# EAGLE schematic schema_puissance (EAGLE 6.4)
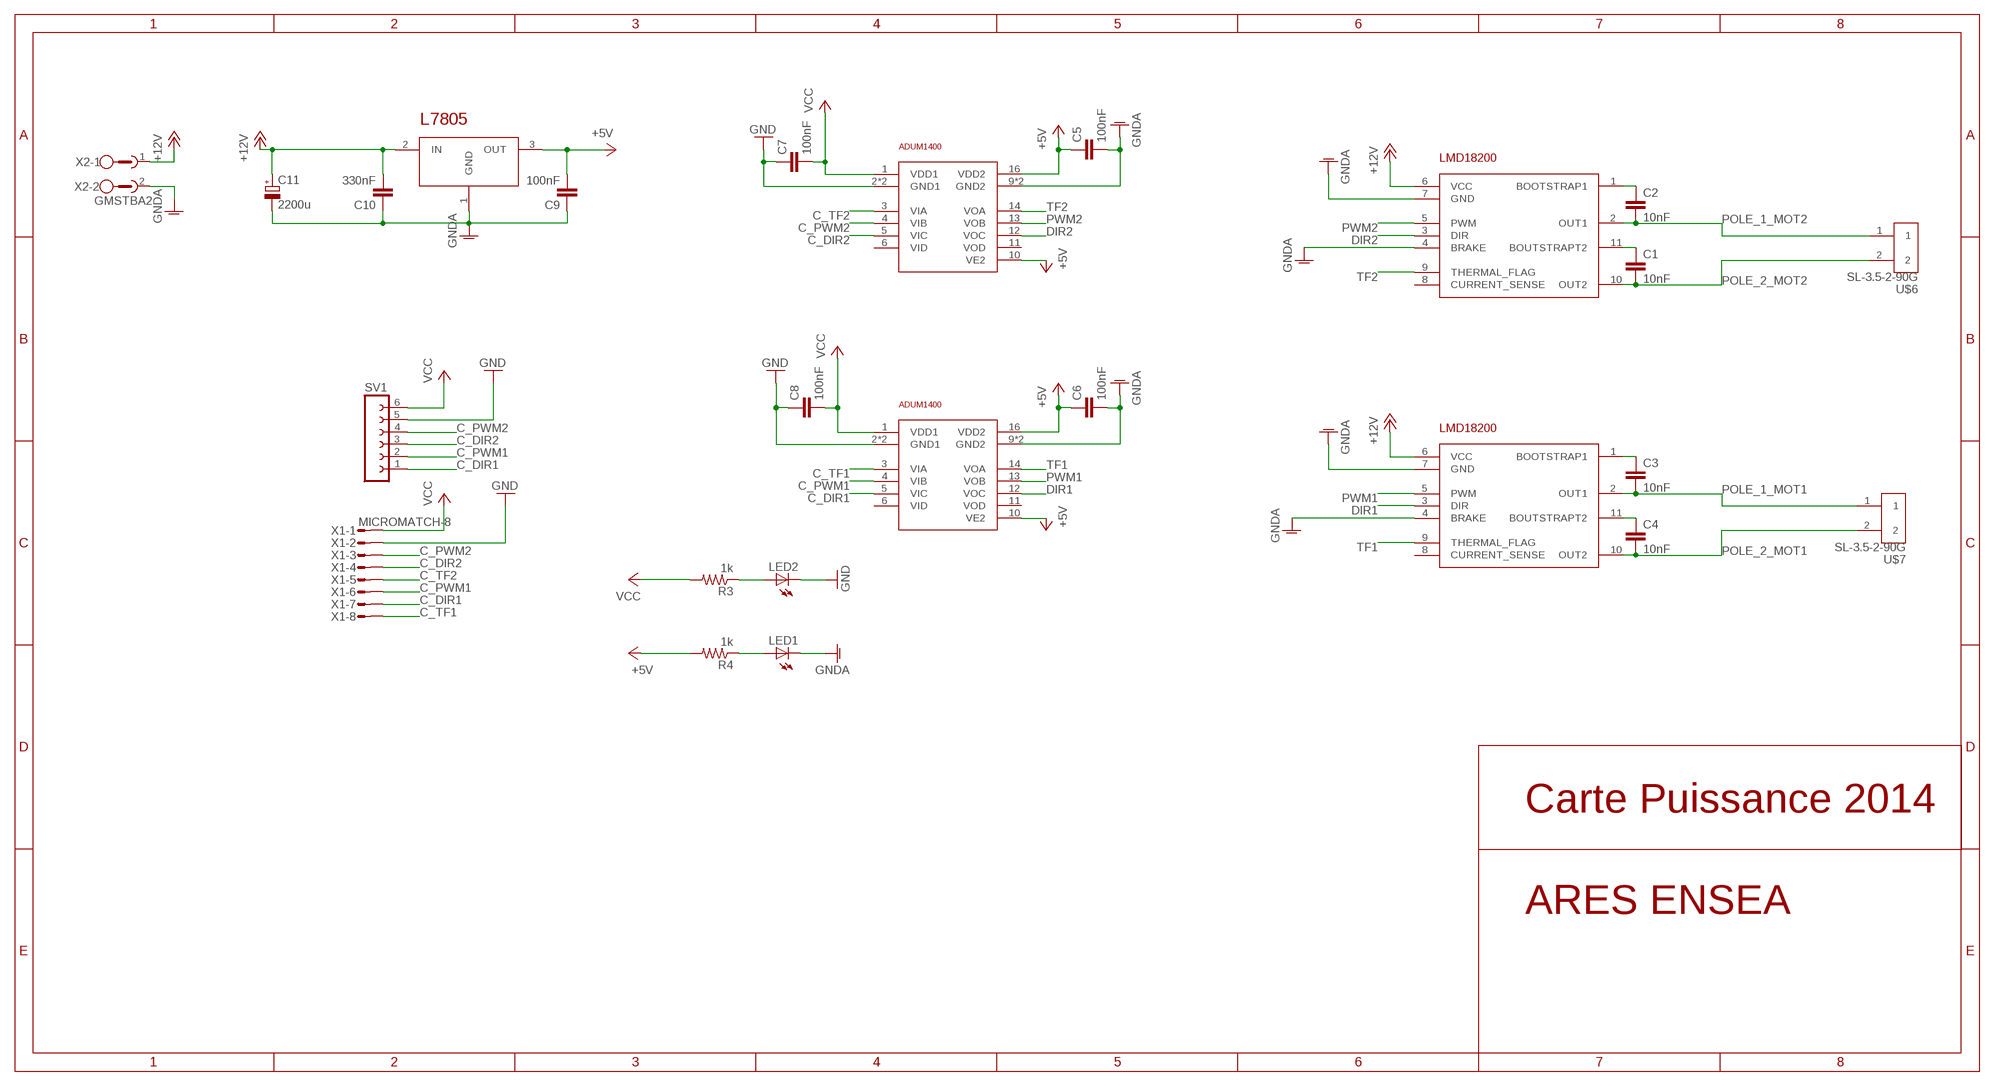
[diagram p0: schematic, sheet 1]

## Parts
C1  10nF  C-EUC0805  [C0805]
C2  10nF  C-EUC0805  [C0805]
C3  10nF  C-EUC0805  [C0805]
C4  10nF  C-EUC0805  [C0805]
C5  100nF  C-EUC0805  [C0805]
C6  100nF  C-EUC0805  [C0805]
C7  100nF  C-EUC0805  [C0805]
C8  100nF  C-EUC0805  [C0805]
C9  100nF  C-EUC0805  [C0805]
C10  330nF  C-EUC0805  [C0805]
C11  2200u  CPOL-EUTT5D11  [TT5D11]
LED1  LEDSML0805  [SML0805]
LED2  LEDSML0805  [SML0805]
R3  1k  R-US_M0805  [M0805]
R4  1k  R-US_M0805  [M0805]
SV1  FE06-1  [FE06]
U$1  LMD18200  [LMD18200]
U$2  LMD18200  [LMD18200]
U$3  ADUM1400S  [SO-16W]
U$4  ADUM1400S  [SO-16W]
U$5  L7805TO263  [DPAK]
U$6  SL-3.5-2-90G  [SL-3.5-2-90G]
U$7  SL-3.5-2-90G  [SL-3.5-2-90G]
X1  MICROMATCH-8  [MICROMATCH-8]
X2  GMSTBA2  [GMSTBA2]

## Nets
+5V: C5.1 C6.1 C9.2 R4.2 U$3.10(VE2) U$3.16(VDD2) U$4.10(VE2) U$4.16(VDD2) U$5.3(OUT)
+12V: C10.2 C11.+ U$1.6(VCC) U$2.6(VCC) U$5.2(IN) X2.1
C_DIR1: SV1.1 U$4.5(VIC) X1.7
C_DIR2: SV1.3 U$3.5(VIC) X1.4
C_PWM1: SV1.2 U$4.4(VIB) X1.6
C_PWM2: SV1.4 U$3.4(VIB) X1.3
C_TF1: U$4.3(VIA) X1.8
C_TF2: U$3.3(VIA) X1.5
DIR1: U$1.3(DIR) U$4.12(VOC)
DIR2: U$2.3(DIR) U$3.12(VOC)
GND: C7.1 C8.1 LED2.C SV1.5 U$3.2(GND1) U$3.8(GND1) U$4.2(GND1) U$4.8(GND1) X1.2
GNDA: C5.2 C6.2 C9.1 C10.1 C11.- LED1.C U$1.4(BRAKE) U$1.7(GND) U$2.4(BRAKE) U$2.7(GND) U$3.9(GND2) U$3.15(GND2) U$4.9(GND2) U$4.15(GND2) U$5.1(GND) X2.2
N$1: C1.1 U$2.11(BOUTSTRAPT2)
N$2: LED1.A R4.1
N$3: C2.1 U$2.1(BOOTSTRAP1)
N$4: LED2.A R3.1
N$5: C3.1 U$1.1(BOOTSTRAP1)
N$7: C4.1 U$1.11(BOUTSTRAPT2)
POLE_1_MOT1: C3.2 U$1.2(OUT1) U$7.1
POLE_1_MOT2: C2.2 U$2.2(OUT1) U$6.1
POLE_2_MOT1: C4.2 U$1.10(OUT2) U$7.2
POLE_2_MOT2: C1.2 U$2.10(OUT2) U$6.2
PWM1: U$1.5(PWM) U$4.13(VOB)
PWM2: U$2.5(PWM) U$3.13(VOB)
TF1: U$1.9(THERMAL_FLAG) U$4.14(VOA)
TF2: U$2.9(THERMAL_FLAG) U$3.14(VOA)
VCC: C7.2 C8.2 R3.2 SV1.6 U$3.1(VDD1) U$4.1(VDD1) X1.1
Unconnected: U$1.8(CURRENT_SENSE) U$2.8(CURRENT_SENSE) U$3.6(VID) U$3.11(VOD) U$4.6(VID) U$4.11(VOD)

## Notes on the sheet
- Carte Puissance 2014
- ARES ENSEA

## Library data of the parts
C1-C10 = rcl:C-EU: CAPACITOR, European symbol
C11 = rcl:CPOL-EU: POLARIZED CAPACITOR, European symbol
LED1 LED2 = led:LED: LED OSRAM: - CHIPLED LG R971, LG N971, LY N971, LG Q971, LY Q971, LO R971, LY R971 LH N974, LH R974 LS Q976, LO Q976, LY Q976 LO Q996 - Hyper CHIPLED LW Q18S LB Q993, LB Q99A, LB R99A - SideLED LS A670, LO A670, LY A670, LG A670, LP A670 LB A673, LV A673, LT A673, LW A673 LH A674 LY A675 LS A676, LA A676, LO A676, LY A676, LW A676 LS A679, LY A679, LG A679 - Hyper Micro SIDELED® LS Y876, LA Y876, LO Y876, LY Y876 LT Y87S - SmartLED LW L88C, LW L88S LB L89C, LB L89S, LG L890 LS L89K, LO L89K, LY L89K LS L896, LA L896, LO L896, LY L896 - TOPLED LS T670, LO T670, LY T670, LG T670, LP T670 LSG T670, LSP T670, LSY T670, LOP T670, LYG T670 LG T671, LOG T671, LSG T671 LB T673, LV T673, LT T673, LW T673 LH T674 LS T676, LA T676, LO T676, LY T676, LB T676, LH T676, LSB T676, LW T676 LB T67C, LV T67C, LT T67C, LS T67K, LO T67K, LY T67K, LW E67C LS E67B, LA E67B, LO E67B, LY E67B, LB E67C, LV E67C, LT E67C LW T67C LS T679, LY T679, LG T679 LS T770, LO T770, LY T770, LG T770, LP T770 LB T773, LV T773, LT T773, LW T773 LH T774 LS E675, LA E675, LY E675, LS T675 LS T776, LA T776, LO T776, LY T776, LB T776 LHGB T686 LT T68C, LB T68C - Hyper Mini TOPLED® LB M676 - Mini TOPLED Santana® LG M470 LS M47K, LO M47K, LY M47K Source: http://www.osram.convergy.de LUXEON: - LUMILED® LXK2-PW12-R00, LXK2-PW12-S00, LXK2-PW14-U00, LXK2-PW14-V00 LXK2-PM12-R00, LXK2-PM12-S00, LXK2-PM14-U00 LXK2-PE12-Q00, LXK2-PE12-R00, LXK2-PE12-S00, LXK2-PE14-T00, LXK2-PE14-U00 LXK2-PB12-K00, LXK2-PB12-L00, LXK2-PB12-M00, LXK2-PB14-N00, LXK2-PB14-P00, LXK2-PB14-Q00 LXK2-PR12-L00, LXK2-PR12-M00, LXK2-PR14-Q00, LXK2-PR14-R00 LXK2-PD12-Q00, LXK2-PD12-R00, LXK2-PD12-S00 LXK2-PH12-R00, LXK2-PH12-S00 LXK2-PL12-P00, LXK2-PL12-Q00, LXK2-PL12-R00 Source: www.luxeon.com KINGBRIGHT: KA-3528ASYC Source: www.kingbright.com
R3 R4 = rcl:R-US_: RESISTOR, American symbol
SV1 = con-lsta:FE06-1: FEMALE HEADER; OC_FARNELL: unknown; OC_NEWARK: unknown
U$1 U$2 = texas:LMD18200
U$3 U$4 = analog-devices:ADUM1400
U$5 = st-microelectronics:L7805
U$6 U$7 = WEIDMULLER:SL-3.5-2-90G
X1 = con-amp-micromatch:MICROMATCH-8: MicroMaTch 8 7-215464-8 / 0-215464-8 Drawing Number C-215464 DDEController.pdf; MF: FARNELL; MPN: 7-215464-8; OC_FARNELL: 3784642; OC_NEWARK: 26H0301
X2 = con-phoenix-762:GMSTBA2: PHOENIX; MF: FARNELL; MPN: 1757242; OC_FARNELL: 3705171; OC_NEWARK: 71C4161